# Altium schematic sheet LPCB218 - OVERVIEW.SchDoc
size A3; Address1: Factory 10; Address2: 9-13 Dingley Avenue, Dandeong, VICTORIA 3175, AUSTRALIA; DocumentNumber: 1; Revision: 1; SheetNumber: 1; SheetTotal: 14; Lockie__PCB_SUB_ASSEMBLY: Top Overview; Lockie__PCB_ASSEMBLY: Command Node; Lockie__LDL: LPCB218; Lockie__PCB_DESCRIPTION: Command Node
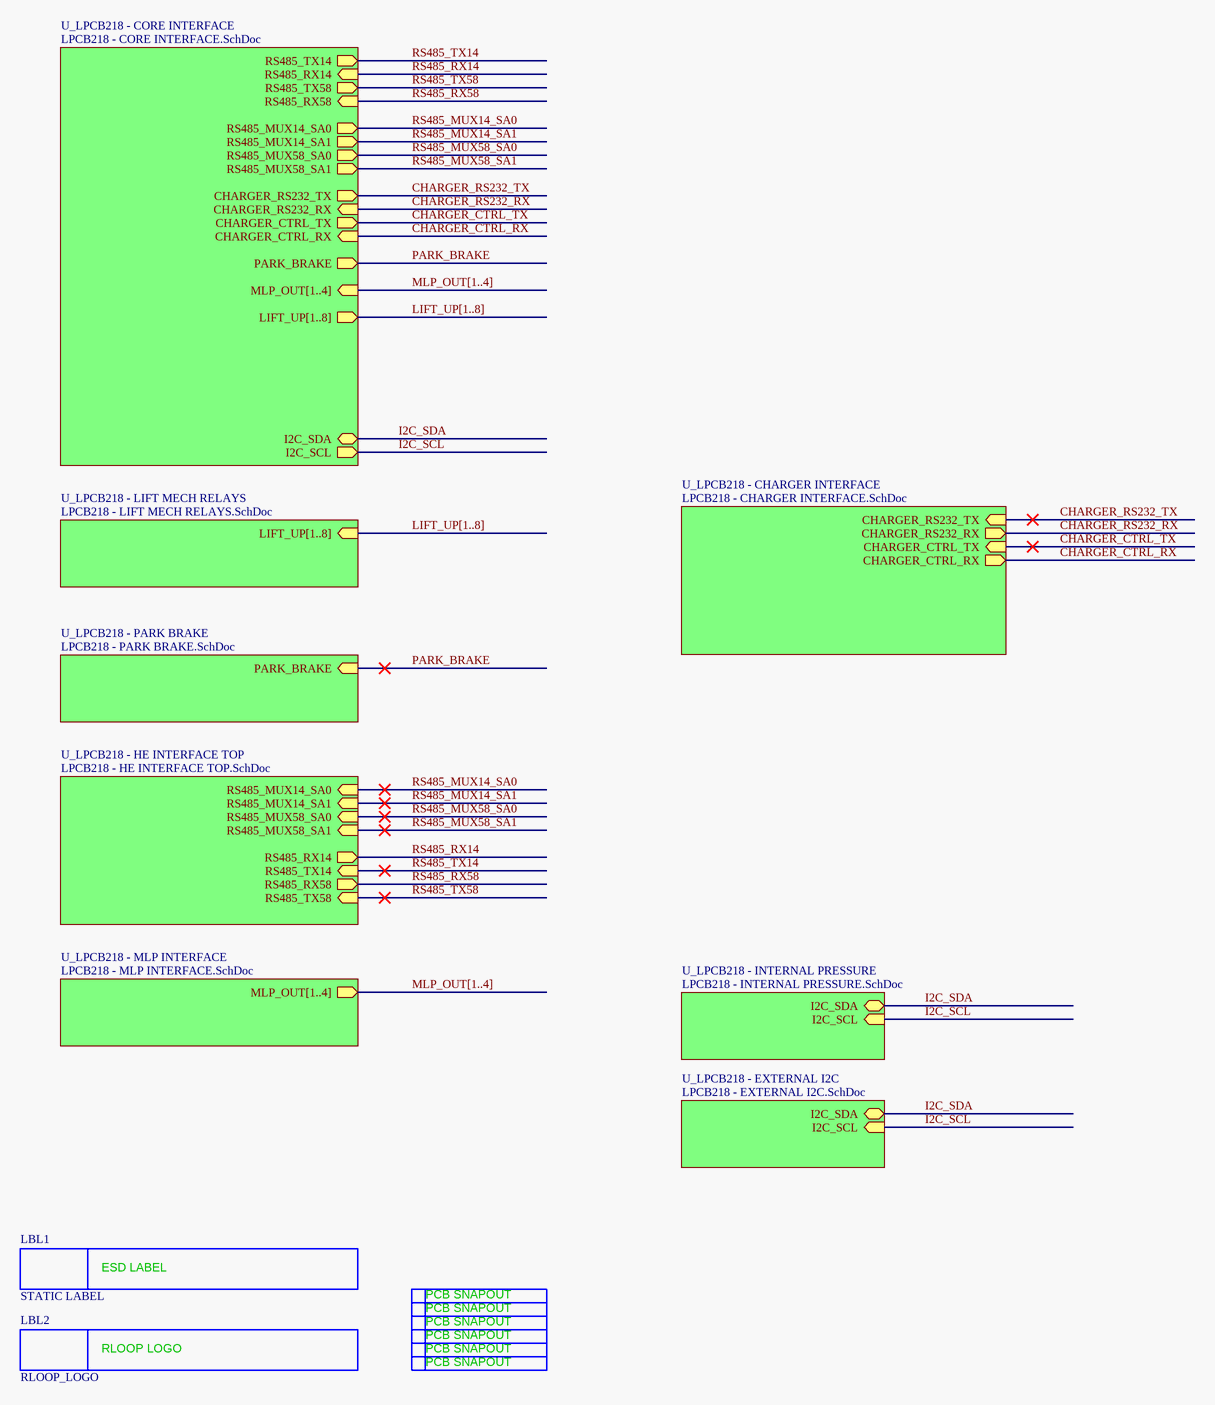
[diagram p0: LPCB218 - OVERVIEW.SchDoc]

## Parts
LBL1  STATIC LABEL  [STATIC_LABEL]  (no BOM)
LBL2  RLOOP_LOGO  [RLOOP_LOGO]  (no BOM)
SN1  PCB_SNAPOUT  [SNAPOUT_NEW]  (value not drawn)  (no BOM)
SN2  PCB_SNAPOUT  [SNAPOUT_NEW]  (value not drawn)  (no BOM)
SN3  PCB_SNAPOUT  [SNAPOUT_NEW]  (value not drawn)  (no BOM)
SN4  PCB_SNAPOUT  [SNAPOUT_NEW]  (value not drawn)  (no BOM)
SN5  PCB_SNAPOUT  [SNAPOUT_NEW]  (value not drawn)  (no BOM)
SN6  PCB_SNAPOUT  [SNAPOUT_NEW]  (value not drawn)  (no BOM)

## Sub-sheets
U_LPCB218 - CHARGER INTERFACE = LPCB218 - CHARGER INTERFACE.SchDoc: CHARGER_RS232_TX (in), CHARGER_CTRL_TX (in), CHARGER_RS232_RX (out), CHARGER_CTRL_RX (out)
U_LPCB218 - CORE INTERFACE = LPCB218 - CORE INTERFACE.SchDoc: RS485_RX14 (in), RS485_TX14 (out), PARK_BRAKE (out), CHARGER_RS232_RX (in), CHARGER_RS232_TX (out), RS485_RX58 (in), RS485_MUX14_SA0 (out), RS485_MUX14_SA1 (out), RS485_MUX58_SA0 (out), RS485_MUX58_SA1 (out), CHARGER_CTRL_TX (out), CHARGER_CTRL_RX (in), MLP_OUT[1..4] (in), LIFT_UP[1..8] (out), RS485_TX58 (out), I2C_SDA (bidir), I2C_SCL (out)
U_LPCB218 - EXTERNAL I2C = LPCB218 - EXTERNAL I2C.SchDoc: I2C_SCL (in), I2C_SDA (bidir)
U_LPCB218 - HE INTERFACE TOP = LPCB218 - HE INTERFACE TOP.SchDoc: RS485_MUX14_SA0 (in), RS485_MUX14_SA1 (in), RS485_MUX58_SA0 (in), RS485_MUX58_SA1 (in), RS485_RX14 (out), RS485_TX14 (in), RS485_RX58 (out), RS485_TX58 (in)
U_LPCB218 - INTERNAL PRESSURE = LPCB218 - INTERNAL PRESSURE.SchDoc: I2C_SDA (bidir), I2C_SCL (in)
U_LPCB218 - LIFT MECH RELAYS = LPCB218 - LIFT MECH RELAYS.SchDoc: LIFT_UP[1..8] (in)
U_LPCB218 - MLP INTERFACE = LPCB218 - MLP INTERFACE.SchDoc: MLP_OUT[1..4] (out)
U_LPCB218 - PARK BRAKE = LPCB218 - PARK BRAKE.SchDoc: PARK_BRAKE (in)

## Nets
CHARGER_CTRL_RX: sheet U_LPCB218 - CHARGER INTERFACE/CHARGER_CTRL_RX, sheet U_LPCB218 - CORE INTERFACE/CHARGER_CTRL_RX
CHARGER_CTRL_TX: sheet U_LPCB218 - CHARGER INTERFACE/CHARGER_CTRL_TX, sheet U_LPCB218 - CORE INTERFACE/CHARGER_CTRL_TX
CHARGER_RS232_RX: sheet U_LPCB218 - CHARGER INTERFACE/CHARGER_RS232_RX, sheet U_LPCB218 - CORE INTERFACE/CHARGER_RS232_RX
CHARGER_RS232_TX: sheet U_LPCB218 - CHARGER INTERFACE/CHARGER_RS232_TX, sheet U_LPCB218 - CORE INTERFACE/CHARGER_RS232_TX
I2C_SCL: sheet U_LPCB218 - CORE INTERFACE/I2C_SCL, sheet U_LPCB218 - INTERNAL PRESSURE/I2C_SCL, sheet U_LPCB218 - EXTERNAL I2C/I2C_SCL
I2C_SDA: sheet U_LPCB218 - CORE INTERFACE/I2C_SDA, sheet U_LPCB218 - INTERNAL PRESSURE/I2C_SDA, sheet U_LPCB218 - EXTERNAL I2C/I2C_SDA
PARK_BRAKE: sheet U_LPCB218 - PARK BRAKE/PARK_BRAKE, sheet U_LPCB218 - CORE INTERFACE/PARK_BRAKE
RS485_MUX14_SA0: sheet U_LPCB218 - HE INTERFACE TOP/RS485_MUX14_SA0, sheet U_LPCB218 - CORE INTERFACE/RS485_MUX14_SA0
RS485_MUX14_SA1: sheet U_LPCB218 - HE INTERFACE TOP/RS485_MUX14_SA1, sheet U_LPCB218 - CORE INTERFACE/RS485_MUX14_SA1
RS485_MUX58_SA0: sheet U_LPCB218 - HE INTERFACE TOP/RS485_MUX58_SA0, sheet U_LPCB218 - CORE INTERFACE/RS485_MUX58_SA0
RS485_MUX58_SA1: sheet U_LPCB218 - HE INTERFACE TOP/RS485_MUX58_SA1, sheet U_LPCB218 - CORE INTERFACE/RS485_MUX58_SA1
RS485_RX14: sheet U_LPCB218 - HE INTERFACE TOP/RS485_RX14, sheet U_LPCB218 - CORE INTERFACE/RS485_RX14
RS485_RX58: sheet U_LPCB218 - HE INTERFACE TOP/RS485_RX58, sheet U_LPCB218 - CORE INTERFACE/RS485_RX58
RS485_TX14: sheet U_LPCB218 - HE INTERFACE TOP/RS485_TX14, sheet U_LPCB218 - CORE INTERFACE/RS485_TX14
RS485_TX58: sheet U_LPCB218 - HE INTERFACE TOP/RS485_TX58, sheet U_LPCB218 - CORE INTERFACE/RS485_TX58

## Buses and harness runs
bus LIFT_UP[1..8] = sheet U_LPCB218 - CORE INTERFACE/LIFT_UP[1..8]
bus LIFT_UP[1..8] = sheet U_LPCB218 - LIFT MECH RELAYS/LIFT_UP[1..8]
bus MLP_OUT[1..4] = sheet U_LPCB218 - CORE INTERFACE/MLP_OUT[1..4]
bus MLP_OUT[1..4] = sheet U_LPCB218 - MLP INTERFACE/MLP_OUT[1..4]

## Notes on the sheet
- PCB COMPONENT DESCRIPTION
- LDL NUMBER
- Assembly Details
- Size
- Drawing File Name
- Revision
- http://rloop.org
- Scale
- A3
- Sheet Details
- N.T.S
- Sheet:
- Of:
- (in symbol PCB_SNAPOUT) PCB SNAPOUT
- (in symbol RLOOP_LOGO) RLOOP LOGO
- (in symbol STATIC LABEL) ESD LABEL

## Library data of the parts
LBL1 = STATIC LABEL: FMEDA__CHANNEL: DIAG; FMEDA__FUNCTION_IN_SYSTEM: *
LBL2 = RLOOP_LOGO: FMEDA__CHANNEL: DIAG; FMEDA__FUNCTION_IN_SYSTEM: *
SN1-SN6 = PCB_SNAPOUT: FMEDA__CHANNEL: DIAG; FMEDA__FUNCTION_IN_SYSTEM: *